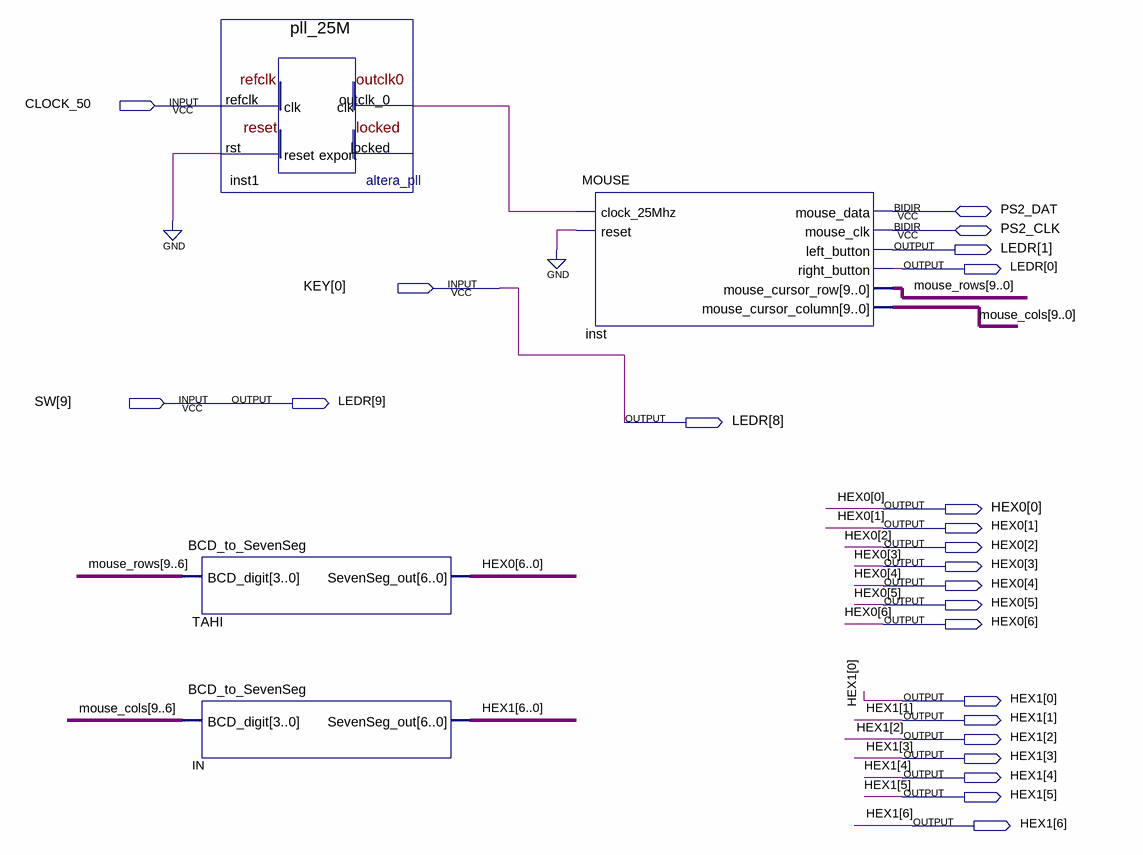
[diagram p0: schematic sheet]
// Quartus schematic mouse_tester.bdf as structural Verilog: 4 symbols, 23 pins
module mouse_tester (
  input  CLOCK_50,
  input  [0:0] KEY,
  input  [9:9] SW,
  inout  PS2_DAT,
  inout  PS2_CLK,
  output [9:0] LEDR,
  output [6:0] HEX0,
  output [6:0] HEX1
);

  wire inst1_outclk_0;
  wire [9:0] mouse_cols, mouse_rows;

  BCD_to_SevenSeg TAHI (.BCD_digit(mouse_rows[9:6]), .SevenSeg_out(HEX0));
  BCD_to_SevenSeg IN (.BCD_digit(mouse_cols[9:6]), .SevenSeg_out(HEX1));
  pll_25M inst1 (.refclk(CLOCK_50), .rst(1'b0), .outclk_0(inst1_outclk_0));  // open: locked
  MOUSE inst (
    .clock_25Mhz(inst1_outclk_0), .reset(1'b0), .left_button(LEDR[1]), .right_button(LEDR[0]),
    .mouse_cursor_row(mouse_rows), .mouse_cursor_column(mouse_cols), .mouse_data(PS2_DAT), .mouse_clk(PS2_CLK));

  assign LEDR[9:8] = {SW[9], KEY[0]};
endmodule
